# EAGLE design SurfaceEEG_Central_V1.0 (EAGLE 7.7.0)
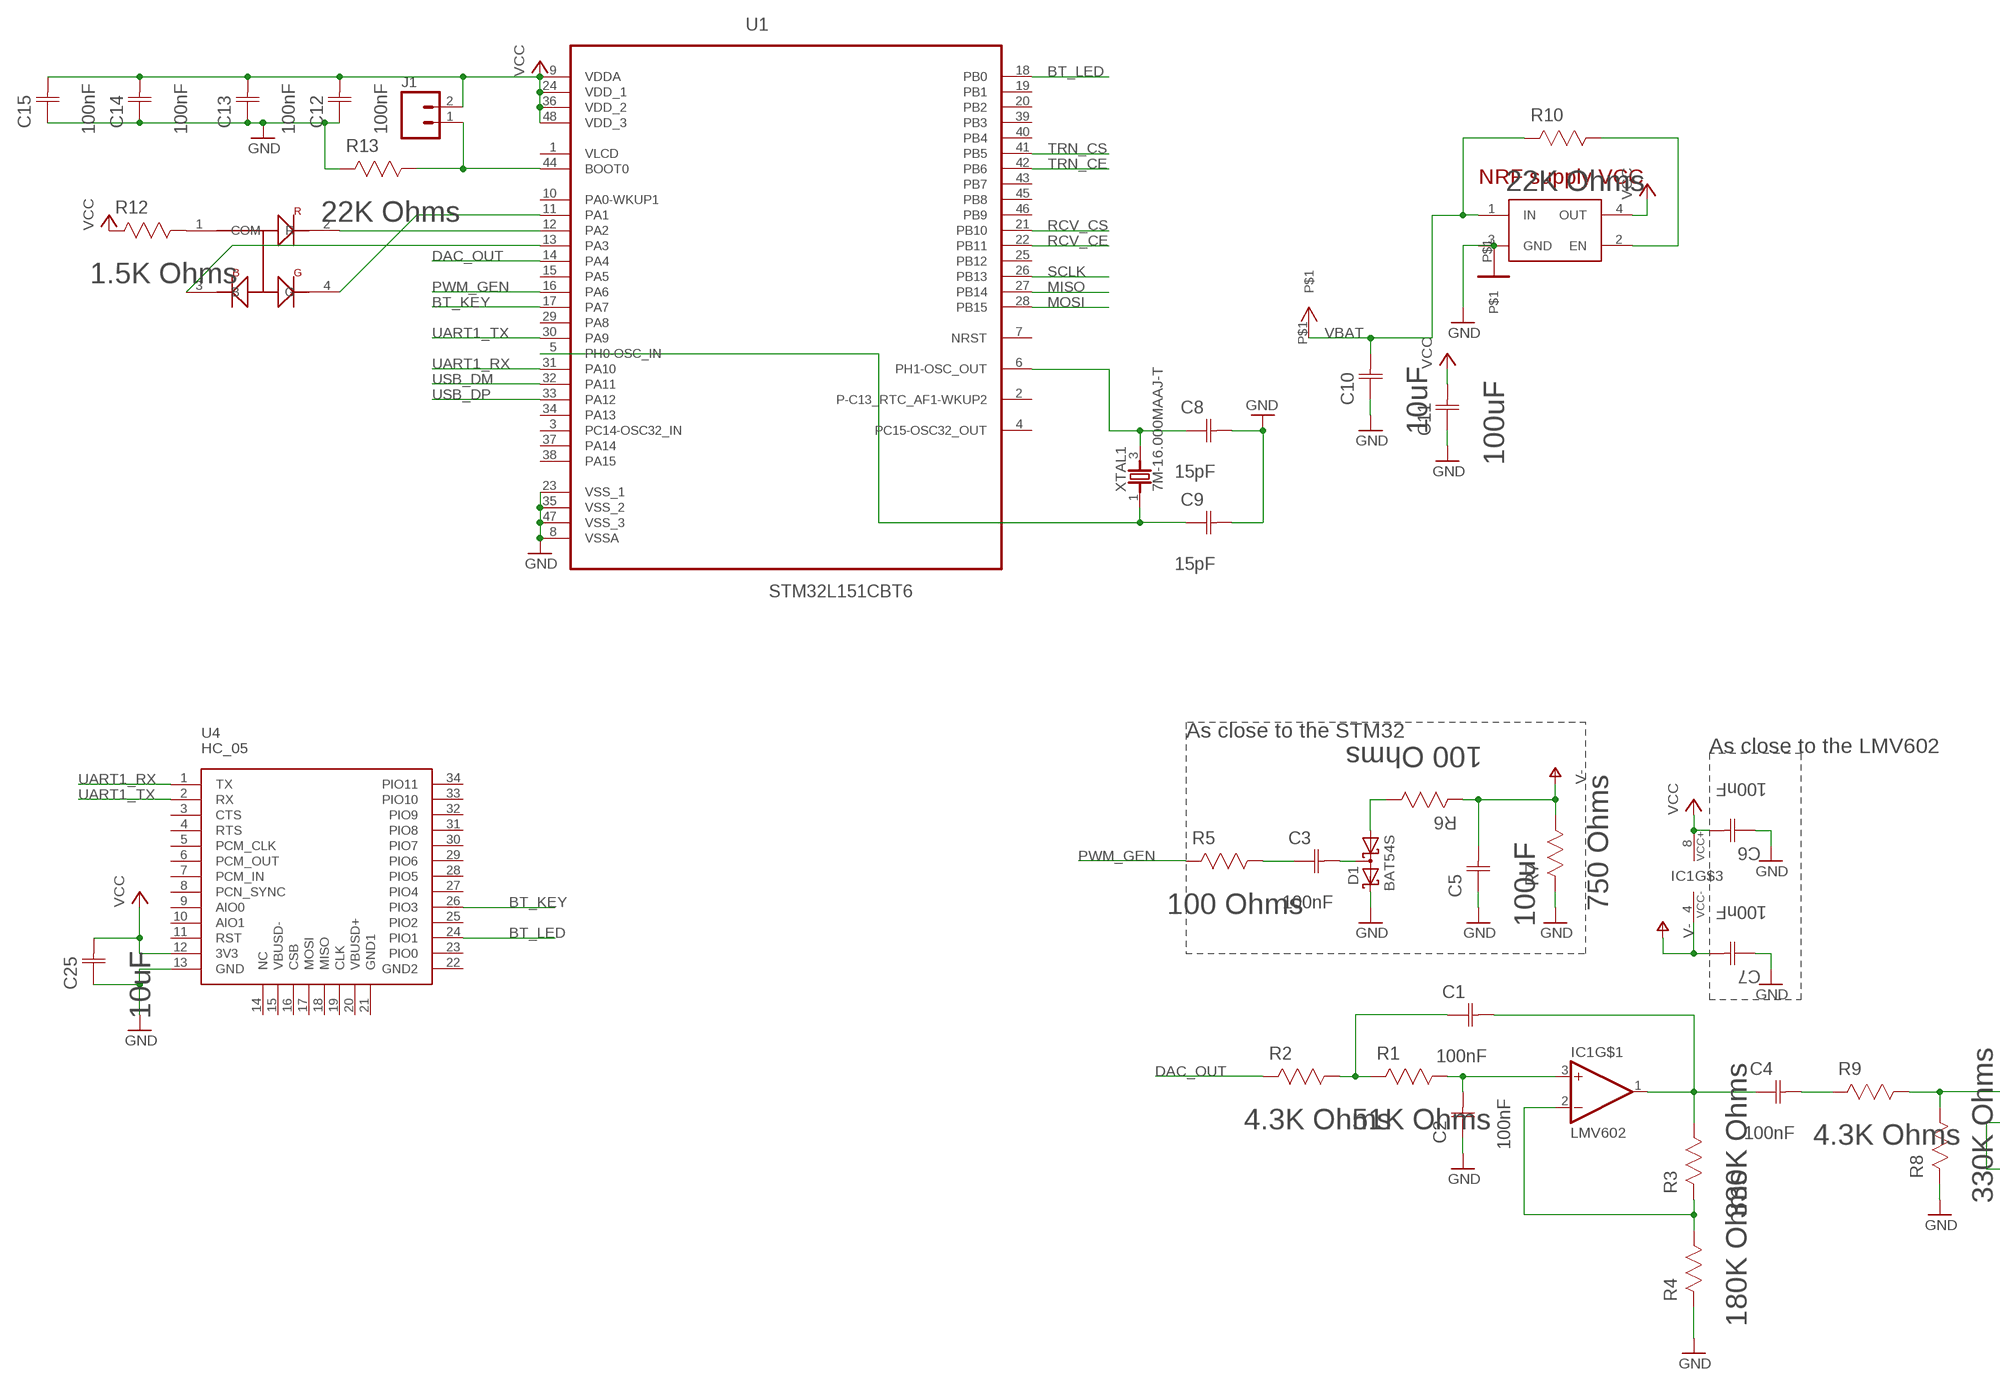
[diagram p0: schematic, sheet 1, part 1 of 2]
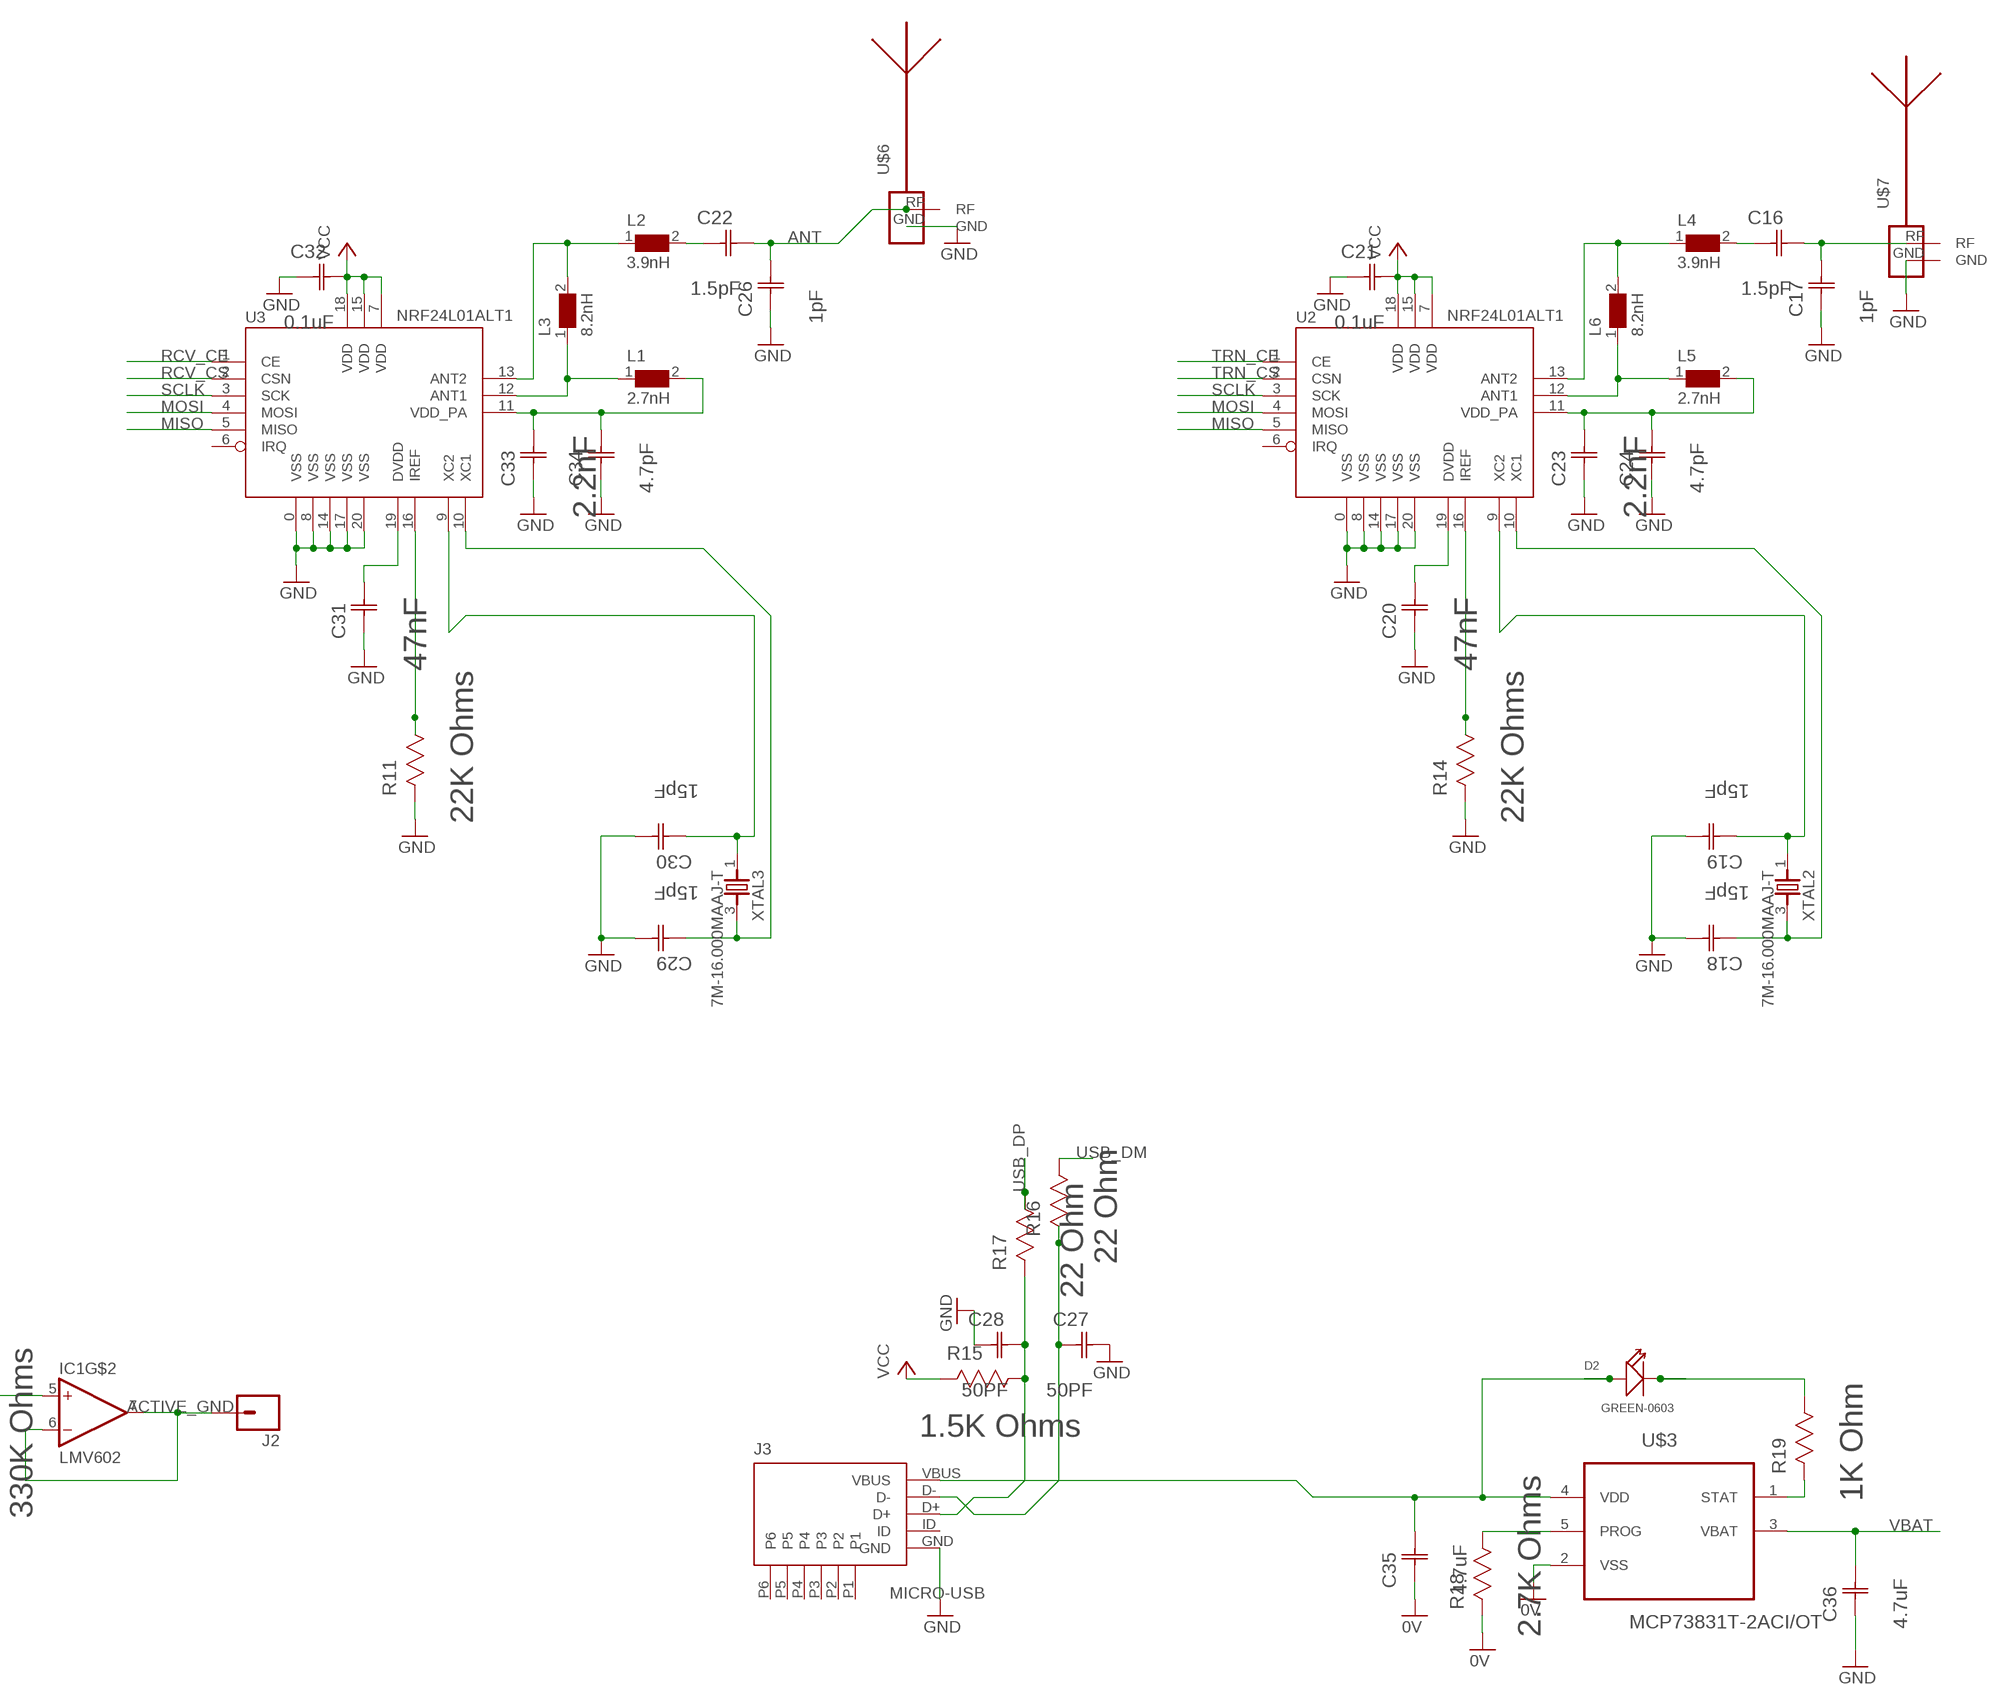
[diagram p1: schematic, sheet 1, part 2 of 2]

## Parts
C1  100nF  06035C104KAT2A  [CAPC1608X90N]
C2  100nF  06035C104KAT2A  [CAPC1608X90N]
C3  100nF  06035C104KAT2A  [CAPC1608X90N]
C4  100nF  06035C104KAT2A  [CAPC1608X90N]
C5  100uF  C1206C107M9PACTU  [CAPC3216X180N]
C6  100nF  06035C104KAT2A  [CAPC1608X90N]
C7  100nF  06035C104KAT2A  [CAPC1608X90N]
C8  15pF  UQCL2A150JAT2A/500  [CAPC1005X60N]
C9  15pF  UQCL2A150JAT2A/500  [CAPC1005X60N]
C10  10uF  C0603C106M9PACTU  [CAPC1608X85N]
C11  100uF  C1206C107M9PACTU  [CAPC3216X180N]
C12  100nF  06035C104KAT2A  [CAPC1608X90N]
C13  100nF  06035C104KAT2A  [CAPC1608X90N]
C14  100nF  06035C104KAT2A  [CAPC1608X90N]
C15  100nF  06035C104KAT2A  [CAPC1608X90N]
C16  1.5pF  UQCL2A1R5BAT2A/500  [CAPC1005X60N]
C17  1pF  UQCL2A1R0BAT2A/500  [CAPC1005X60N]
C18  15pF  UQCL2A150JAT2A/500  [CAPC1005X60N]
C19  15pF  UQCL2A150JAT2A/500  [CAPC1005X60N]
C20  47nF  C0603C473K1RACTU  [CAPC1608X85N]
C21  0.1uF  04023C104KAT2A  [CAPC1005X60N]
C22  1.5pF  UQCL2A1R5BAT2A/500  [CAPC1005X60N]
C23  2.2nF  C0402C222K5RACTU  [CAPC1005X60N]
C24  4.7pF  UQCL2A4R7CAT2A/500  [CAPC1005X60N]
C25  10uF  C0603C106M9PACTU  [CAPC1608X85N]
C26  1pF  UQCL2A1R0BAT2A/500  [CAPC1005X60N]
C27  50PF  06035A500JAT2A  [CAPC1608X90N]
C28  50PF  06035A500JAT2A  [CAPC1608X90N]
C29  15pF  UQCL2A150JAT2A/500  [CAPC1005X60N]
C30  15pF  UQCL2A150JAT2A/500  [CAPC1005X60N]
C31  47nF  C0603C473K1RACTU  [CAPC1608X85N]
C32  0.1uF  04023C104KAT2A  [CAPC1005X60N]
C33  2.2nF  C0402C222K5RACTU  [CAPC1005X60N]
C34  4.7pF  UQCL2A4R7CAT2A/500  [CAPC1005X60N]
C35  4.7uF  0805YC475KAT2A  [CAPC2013X152N]
C36  4.7uF  0805YC475KAT2A  [CAPC2013X152N]
D1  BAT54S  [SOT23]
D2  GREEN-0603  SMD-LED-CLEAR-GREEN(0603)  [LED-0603]
IC1  LMV602  [VSSOP8]
J1  M02PTH  [1X02]
J2  M01SMD-4.5X1.5  [PAD-1.5X4.5]
J3  MICRO-USB  [MICRO_USB]
L1  2.7nH  WE-KI-744765027A_0402A  [WE-KI_0402A]
L2  3.9nH  WE-KI-744765039A_0402A  [WE-KI_0402A]
L3  8.2nH  WE-KI-744765082A_0402A  [WE-KI_0402A]
L4  3.9nH  WE-KI-744765039A_0402A  [WE-KI_0402A]
L5  2.7nH  WE-KI-744765027A_0402A  [WE-KI_0402A]
L6  8.2nH  WE-KI-744765082A_0402A  [WE-KI_0402A]
R1  51K Ohms  RC0603FR-0751KL  [RESC1608X60N]
R2  4.3K Ohms  RC0603FR-074K3L  [RESC1608X60N]
R3  330K Ohms  RC0603JR-07330KL  [RESC1608X60N]
R4  180K Ohms  RC0603JR-07180KL  [RESC1608X60N]
R5  100 Ohms  RC0603FR-07100RL  [RESC1608X60N]
R6  100 Ohms  RC0603FR-07100RL  [RESC1608X60N]
R7  750 Ohms  RC0603FR-07750RL  [RESC1608X60N]
R8  330K Ohms  RC0603JR-07330KL  [RESC1608X60N]
R9  4.3K Ohms  RC0603FR-074K3L  [RESC1608X60N]
R10  22K Ohms  RC0603FR-0722KL  [RESC1608X60N]
R11  22K Ohms  RC0603FR-0722KL  [RESC1608X60N]
R12  1.5K Ohms  RC0603FR-071K5L  [RESC1608X60N]
R13  22K Ohms  RC0603FR-0722KL  [RESC1608X60N]
R14  22K Ohms  RC0603FR-0722KL  [RESC1608X60N]
R15  1.5K Ohms  RC0603FR-071K5L  [RESC1608X60N]
R16  22 Ohm  9C06031A22R0JLHFT  [RESC1608X60N]
R17  22 Ohm  9C06031A22R0JLHFT  [RESC1608X60N]
R18  2.7K Ohms  RC0603FR-072K7L  [RESC1608X60N]
R19  1K Ohm  9C06031A1001JLHFT  [RESC1608X60N]
U1  STM32L151CBT6  [QFP50P900X900X160-48N]
U2  NRF24L01ALT1  [QFN20_ALT1]
U3  NRF24L01ALT1  [QFN20_ALT1]
U4  HC_05  [BLUETOOTH_SMD]
U$1  NCP103  [UDFN4-1*1]
U$2  RGB-LED  [1615-RGB-LED]
U$3  MCP73831T-2ACI/OT  [SOT95P280X145-5N]
U$4  VCC  [VCC-PAD]
U$5  GND  [GND-PAD]
U$6  ANTENNA_1LEFT  [SWRA117D_LEFT]
U$7  ANTENNA_1RIGHT  [SWRA117D_RIGHT]
XTAL1  7M-16.000MAAJ-T  [TXC_7M-16.000MAAJ-T]
XTAL2  7M-16.000MAAJ-T  [TXC_7M-16.000MAAJ-T]
XTAL3  7M-16.000MAAJ-T  [TXC_7M-16.000MAAJ-T]

## Nets
0V: C35.1(C1) R18.2(R2) U$3.2(VSS)
ACTIVE_GND: IC1.6(IN-) IC1.7(OUT) J2.P$1
ANT: C22.1(C2) C26.1(C2) U$6.RF
ANT1: L1.1 L3.1 U3.12(ANT1)
ANT2: L2.1 L3.2 U3.13(ANT2)
ANT3: L4.1 L6.2 U2.13(ANT2)
ANT4: L5.1 L6.1 U2.12(ANT1)
BT_KEY: U1.17(PA7) U4.26(PIO3)
BT_LED: U1.18(PB0) U4.24(PIO1)
DAC_OUT: R2.2(R2) U1.14(PA4)
GND: C2.1(C1) C5.1(C1) C6.1(C1) C7.1(C1) C8.1(C2) C9.1(C2) C10.1(C1) C11.1(C1) C12.1(C1) C13.1(C1) C14.1(C1) C15.1(C1) C17.2(C1) C18.1(C2) C19.1(C2) C20.1(C1) C21.2(C1) C23.1(C1) C24.2(C1) C25.1(C1) C26.2(C1) C27.2(C2) C28.1(C1) C29.1(C2) C30.1(C2) C31.1(C1) C32.2(C1) C33.1(C1) C34.2(C1) C36.1(C1) D1.2(C2) J3.GND R4.2(R2) R7.2(R2) R8.2(R2) R11.2(R2) R13.2(R2) R14.2(R2) U1.8(VSSA) U1.23(VSS_1) U1.35(VSS_2) U1.47(VSS_3) U2.0(VSS) U2.8(VSS) U2.14(VSS) U2.17(VSS) U2.20(VSS) U3.0(VSS) U3.8(VSS) U3.14(VSS) U3.17(VSS) U3.20(VSS) U4.13(GND) U$1.3(GND) U$5.P$1 U$6.GND U$7.GND
MISO: U1.27(PB14) U2.5(MISO) U3.5(MISO)
MOSI: U1.28(PB15) U2.4(MOSI) U3.4(MOSI)
N$1: C1.1(C1) R1.2(R2) R2.1(R1)
N$2: IC1.2(IN-) R3.2(R2) R4.1(R1)
N$3: C1.2(C2) C4.1(C1) IC1.1(OUT) R3.1(R1)
N$4: C2.2(C2) IC1.3(IN+) R1.1(R1)
N$5: IC1.5(IN+) R8.1(R1) R9.1(R1)
N$6: C4.2(C2) R9.2(R2)
N$7: C3.1(C1) R5.1(R1)
N$8: C3.2(C2) D1.3(C1A2)
N$9: D1.1(A1) R6.1(R1)
N$10: C29.2(C1) U3.10(XC1) XTAL3.3
N$11: R10.1(R1) U$1.2(EN)
N$12: C30.2(C1) U3.9(XC2) XTAL3.1
N$13: C22.2(C1) L2.2
N$14: C8.2(C1) U1.6(PH1-OSC_OUT) XTAL1.3
N$15: C9.2(C1) U1.5(PH0-OSC_IN) XTAL1.1
N$16: C33.2(C2) C34.1(C2) L1.2 U3.11(VDD_PA)
N$17: U1.12(PA2) U$2.2(R)
N$18: U1.13(PA3) U$2.3(B)
N$19: R11.1(R1) U3.16(IREF)
N$20: C31.2(C2) U3.19(DVDD)
N$21: U1.11(PA1) U$2.4(G)
N$22: R12.1(R1) U$2.1(COM)
N$23: J1.1 R13.1(R1) U1.44(BOOT0)
N$24: C18.2(C1) U2.10(XC1) XTAL2.3
N$25: C23.2(C2) C24.1(C2) L5.2 U2.11(VDD_PA)
N$26: R14.1(R1) U2.16(IREF)
N$27: C20.2(C2) U2.19(DVDD)
N$28: C16.2(C1) L4.2
N$29: C19.2(C1) U2.9(XC2) XTAL2.1
N$30: C16.1(C2) C17.1(C2) U$7.RF
N$31: C35.2(C2) D2.+ J3.VBUS U$3.4(VDD)
N$32: C28.2(C2) J3.D+ R15.1(R1) R17.2(R2)
N$33: C27.1(C1) J3.D- R16.2(R2)
N$34: R18.1(R1) U$3.5(PROG)
N$36: D2.- R19.1(R1)
N$37: R19.2(R2) U$3.1(STAT)
PWM_GEN: R5.2(R2) U1.16(PA6)
RCV_CE: U1.22(PB11) U3.1(CE)
RCV_CS: U1.21(PB10) U3.2(CSN)
SCLK: U1.26(PB13) U2.3(SCK) U3.3(SCK)
TRN_CE: U1.42(PB6) U2.1(CE)
TRN_CS: U1.41(PB5) U2.2(CSN)
UART1_RX: U1.31(PA10) U4.1(TX)
UART1_TX: U1.30(PA9) U4.2(RX)
USB_DM: R16.1(R1) U1.32(PA11)
USB_DP: R17.1(R1) U1.33(PA12)
V-: C5.2(C2) C7.2(C2) IC1.4(VCC-) R6.2(R2) R7.1(R1)
VBAT: C10.2(C2) C36.2(C2) R10.2(R2) U$1.1(IN) U$3.3(VBAT) U$4.P$1
VCC: C6.2(C2) C11.2(C2) C12.2(C2) C13.2(C2) C14.2(C2) C15.2(C2) C21.1(C2) C25.2(C2) C32.1(C2) IC1.8(VCC+) J1.2 R12.2(R2) R15.2(R2) U1.9(VDDA) U1.24(VDD_1) U1.36(VDD_2) U1.48(VDD_3) U2.7(VDD) U2.15(VDD) U2.18(VDD) U3.7(VDD) U3.15(VDD) U3.18(VDD) U4.12(3V3) U$1.4(OUT)
Unconnected: J3.ID J3.P1 J3.P2 J3.P3 J3.P4 J3.P5 J3.P6 U1.2(P-C13_RTC_AF1-WKUP2) U1.3(PC14-OSC32_IN) U1.4(PC15-OSC32_OUT) U1.7(NRST) U1.10(PA0-WKUP1) U1.15(PA5) U1.19(PB1) U1.20(PB2) U1.25(PB12) U1.29(PA8) U1.34(PA13) U1.37(PA14) U1.38(PA15) U1.39(PB3) U1.40(PB4) U1.43(PB7) U1.45(PB8) U1.46(PB9) U2.6(IRQ) U3.6(IRQ) U4.3(CTS) U4.4(RTS) U4.5(PCM_CLK) U4.6(PCM_OUT) U4.7(PCM_IN) U4.8(PCN_SYNC) U4.9(AIO0) U4.10(AIO1) U4.11(RST) U4.14(NC) U4.15(VBUSD-) U4.16(CSB) U4.17(MOSI) U4.18(MISO) U4.19(CLK) U4.20(VBUSD+) U4.21(GND1) U4.22(GND2) U4.23(PIO0) U4.25(PIO2) U4.27(PIO4) U4.28(PIO5) U4.29(PIO6) U4.30(PIO7) U4.31(PIO8) U4.32(PIO9) U4.33(PIO10) U4.34(PIO11)

## Notes on the sheet
- NRF supply VCC
- As close to the STM32
- As close to the LMV602

## Power pins joined to a net without a drawn wire
VLCD: U1.1(VLCD)

## Library data of the parts
C1-C4 C6 C7 C12-C15 = (manufact)-capacitors-AVX-element14:06035C104KAT2A: Capacitor 0603; MPN: 06035C104KAT2A; OC_FARNELL: 1301804; OC_NEWARK: 54K2412; SUPPLIER: AVX; TOLERANCE: ±10%; VOLTAGERATING: 50V
C5 C11 = (manufact)-Kemet-element14:C1206C107M9PACTU: CAPACITOR, 1206; MPN: C1206C107M9PACTU; OC_FARNELL: 1358552; OC_NEWARK: 94M5669; SUPPLIER: Kemet; TOLERANCE: ±20%; VOLTAGERATING: 6.3V
C8 C9 C18 C19 C29 C30 = (manufact)-capacitors-AVX-element14:UQCL2A150JAT2A/500: Capacitor 0402; MPN: UQCL2A150JAT2A/500; OC_FARNELL: -; OC_NEWARK: 32T8795; SUPPLIER: AVX; TOLERANCE: ±5%; VOLTAGERATING: 200V
C10 C25 = (manufact)-Kemet-element14:C0603C106M9PACTU: CAPACITOR, 0603; MPN: C0603C106M9PACTU; OC_FARNELL: 1288201; OC_NEWARK: 93K5998; SUPPLIER: Kemet; TOLERANCE: ±20%; VOLTAGERATING: 6.3V
C16 C22 = (manufact)-capacitors-AVX-element14:UQCL2A1R5BAT2A/500: Capacitor 0402; MPN: UQCL2A1R5BAT2A/500; OC_FARNELL: -; OC_NEWARK: 32T8784; SUPPLIER: AVX; TOLERANCE: ±.1 pF; VOLTAGERATING: 200V
C17 C26 = (manufact)-capacitors-AVX-element14:UQCL2A1R0BAT2A/500: Capacitor 0402; MPN: UQCL2A1R0BAT2A/500; OC_FARNELL: -; OC_NEWARK: 32T8778; SUPPLIER: AVX; TOLERANCE: ±.1 pF; VOLTAGERATING: 200V
C20 C31 = (manufact)-Kemet-element14:C0603C473K1RACTU: CAPACITOR, 0603; MPN: C0603C473K1RACTU; OC_FARNELL: 1865550; OC_NEWARK: 29T9032; SUPPLIER: KEMET; TOLERANCE: ±10%; VOLTAGERATING: 100V
C21 C32 = (manufact)-capacitors-AVX-element14:04023C104KAT2A: Capacitor 0402; MPN: 04023C104KAT2A; OC_FARNELL: 1867948; OC_NEWARK: 37T9047; SUPPLIER: AVX; TOLERANCE: ±10%; VOLTAGERATING: 25V
C23 C33 = (manufact)-Kemet-element14:C0402C222K5RACTU: CAPACITOR, 0402; MPN: C0402C222K5RACTU; OC_FARNELL: 1414582; OC_NEWARK: 70K9080; SUPPLIER: Kemet; TOLERANCE: ±10%; VOLTAGERATING: 50V
C24 C34 = (manufact)-capacitors-AVX-element14:UQCL2A4R7CAT2A/500: Capacitor 0402; MPN: UQCL2A4R7CAT2A/500; OC_FARNELL: -; OC_NEWARK: 32T8823; SUPPLIER: AVX; TOLERANCE: ±.25 pF; VOLTAGERATING: 200V
C27 C28 = (manufact)-capacitors-AVX-element14:06035A500JAT2A: CAPACITOR , 0603; MPN: 06035A500JAT2A; OC_FARNELL: -; OC_NEWARK: 55J4427; SUPPLIER: AVX; TOLERANCE: ±5%; VOLTAGERATING: 50V
C35 C36 = (manufact)-capacitors-AVX-element14:0805YC475KAT2A: Capacitor 0805; MPN: 0805YC475KAT2A; OC_FARNELL: 1657937; OC_NEWARK: 15P4051; SUPPLIER: AVX; TOLERANCE: ±10%; VOLTAGERATING: 16V
D1 = (misc)-parts-that-we-use:BAT54S: Schottky Diodes Pin connection corrected 2011-05-04 Source: Fairchild .. BAT54.pdf
D2 = Seeed-OPL-Diode:SMD-LED-CLEAR-GREEN(0603): 304090043; MPN: 19-217-G7C-AN1P2-3T
IC1 = (custom)-new-components:LMV602: The library has been designed by Richard Magdycz <https://www.facebook.com/groups/eaglecadsoftUK>; MPN: LMV602MM/NOPB
J1 = SparkFun-Connectors:M02: Standard 2-pin 0.1" header. Use with - straight break away headers ( PRT-00116) - right angle break away headers (PRT-00553) - swiss pins (PRT-00743) - machine pins (PRT-00117) - female headers (PRT-00115) Molex polarized connector foot print use with: PRT-08233 with associated crimp pins and housings. 2.54_SCREWTERM for use with PRT-10571. 3.5mm Screw Terminal footprints for PRT-08084 5mm Screw Terminal footprints for use with PRT-08432
J2 = SparkFun-Connectors:M01: Header 1 Standard 1-pin 0.1" header. Use with straight break away headers (SKU : PRT-00116), right angle break away headers (PRT-00553), swiss pins (PRT-00743), machine pins (PRT-00117), and female headers (PRT-00115). SMTSO-256-ET is a "flush mount" nut for a 4-40 screw. The older package used to be too tight, and did not allow it to sit properly thru the drill hit. The latest (0.165DIA) fits nice and snug.
J3 = (misc)-parts-that-we-use:MICRO-USB: Micro USB from Molex CONN RCPT 5POS MICRO USB R/A Datasheet <http://www.molex.com/pdm_docs/sd/473460001_sd.pdf>; MPN: 47346-0001; PARTNO: AS-ITM-00021
L1 L5 = (manufact)-inductors-WE-KI-element14:WE-KI: SMD Wire Wound Ceramic Inductor WE-KI - Wire wound - High thermal stability - Rated current up to 1 A - High Q-factor - High SRF - Inductance tolerances: 5% (2% upon request) -- Especially developed for high frequency applications -- Perfect for applications in telecommunications -- Bluetooth -- Wireless LAN; MPN: 744765027A; OC_FARNELL: 1748703; OC_NEWARK: 34R6062; PACKAGE: IND-0402; SUPPLIER: Wuerth Elektronik
L2 L4 = (manufact)-inductors-WE-KI-element14:WE-KI: SMD Wire Wound Ceramic Inductor WE-KI - Wire wound - High thermal stability - Rated current up to 1 A - High Q-factor - High SRF - Inductance tolerances: 5% (2% upon request) -- Especially developed for high frequency applications -- Perfect for applications in telecommunications -- Bluetooth -- Wireless LAN; MPN: 744765039A; OC_FARNELL: 1748706; OC_NEWARK: 34R6065; PACKAGE: IND-0402; SUPPLIER: Wuerth Elektronik
L3 L6 = (manufact)-inductors-WE-KI-element14:WE-KI: SMD Wire Wound Ceramic Inductor WE-KI - Wire wound - High thermal stability - Rated current up to 1 A - High Q-factor - High SRF - Inductance tolerances: 5% (2% upon request) -- Especially developed for high frequency applications -- Perfect for applications in telecommunications -- Bluetooth -- Wireless LAN; MPN: 744765082A; OC_FARNELL: 1748715; OC_NEWARK: 34R6073; PACKAGE: IND-0402; SUPPLIER: Wuerth Elektronik
R1 = (manufact)-resistors-YAGEO-element14:RC0603FR-0751KL: RESISTOR, 0603; MPN: RC0603FR-0751KL; OC_FARNELL: 1799349; OC_NEWARK: 68R0103; SUPPLIER: Yageo; TOLERANCE: ±1%; WATTAGE: 1/10 W
R2 R9 = (manufact)-resistors-YAGEO-element14:RC0603FR-074K3L: RESISTOR, 0603; MPN: RC0603FR-074K3L; OC_FARNELL: -; OC_NEWARK: 06R3079; SUPPLIER: Yageo; TOLERANCE: ±1%; WATTAGE: 1/10 W
R3 R8 = (manufact)-resistors-YAGEO-element14:RC0603JR-07330KL: RESISTOR, 0603; MPN: RC0603JR-07330KL; OC_FARNELL: 9233687; OC_NEWARK: 68R0183; SUPPLIER: Yageo; TOLERANCE: ±5%; WATTAGE: 1/10 W
R4 = (manufact)-resistors-YAGEO-element14:RC0603JR-07180KL: RESISTOR, 0603; MPN: RC0603JR-07180KL; OC_FARNELL: 9233652; OC_NEWARK: 98K7301; SUPPLIER: Yageo; TOLERANCE: ±5%; WATTAGE: 1/10 W
R5 R6 = (manufact)-resistors-YAGEO-element14:RC0603FR-07100RL: RESISTOR, 0603; MPN: RC0603FR-07100RL; OC_FARNELL: 1117232; OC_NEWARK: 68R0052; SUPPLIER: Yageo; TOLERANCE: ±1%; WATTAGE: 1/10 W
R7 = (manufact)-resistors-YAGEO-element14:RC0603FR-07750RL: RESISTOR, 0603; MPN: RC0603FR-07750RL; OC_FARNELL: -; OC_NEWARK: 51P2986; SUPPLIER: Yageo; TOLERANCE: ±1%; WATTAGE: 1/10 W
R10 R11 R13 R14 = (manufact)-resistors-YAGEO-element14:RC0603FR-0722KL: RESISTOR, 0603; MPN: RC0603FR-0722KL; OC_FARNELL: 1117251; OC_NEWARK: 68R0072; SUPPLIER: Yageo; TOLERANCE: ±1%; WATTAGE: 1/10 W
R12 R15 = (manufact)-resistors-YAGEO-element14:RC0603FR-071K5L: RESISTOR, 0603; MPN: RC0603FR-071K5L; OC_FARNELL: 1117242; OC_NEWARK: 68R0045; SUPPLIER: Yageo; TOLERANCE: ±1%; WATTAGE: 1/10 W
R16 R17 = (manufact)-resistors-YAGEO-element14:9C06031A22R0JLHFT: RESISTOR, 0603; MPN: 9C06031A22R0JLHFT; OC_FARNELL: -; OC_NEWARK: 96H0458; SUPPLIER: Yageo; TOLERANCE: ±5%; WATTAGE: 0.1 W
R18 = (manufact)-resistors-YAGEO-element14:RC0603FR-072K7L: RESISTOR, 0603; MPN: RC0603FR-072K7L; OC_FARNELL: 9238530; OC_NEWARK: 68R0067; SUPPLIER: Yageo; TOLERANCE: ±1%; WATTAGE: 1/10 W
R19 = (manufact)-resistors-YAGEO-element14:9C06031A1001JLHFT: RESISTOR, 0603; MPN: 9C06031A1001JLHFT; OC_FARNELL: -; OC_NEWARK: 37J1397; SUPPLIER: Yageo; TOLERANCE: ±5%; WATTAGE: 0.1 W
U1 = (misc)-parts-that-we-use:STM32L151CBT6: ARM-based 32-bit MCU; MPN: STM32L151CBT6; OC_FARNELL: 2060925; OC_NEWARK: 65T3786; PACKAGE: LQFP-48; SUPPLIER: STMICROELECTRONICS
U2 U3 = Testing:NRF24L01: 2.4GHz Low Power Transceiver This is the very popular, low cost, very low power RF transceiver from Nordic Semiconductor. Simple SPI interface. SKU: COM-00690
U4 = HC_08:HC_05: HC-05 Bluetooth Module
U$1 = (custom)-new-components:NCP103: NCP103AMX330TCG 3.3V LDO: 75mV dropout, 150 mA http://www.onsemi.com/pub_link/Collateral/NCP103-D.PDF; MPN: NCP103AMX330TCG
U$2 = (custom)-new-components:RGB-LED
U$3 = (custom)-new-components:MCP73831T-2ACI/OT: Charge Management Controller; MPN: MCP73831T-2ACI/OT; OC_FARNELL: 1332158; OC_NEWARK: 56K7045; PACKAGE: SOT-5; SUPPLIER: Microchip
U$4 = (custom)-new-components:VCC
U$5 = (custom)-new-components:GND
U$6 U$7 = ant-planar-1:ANTENNA_1
XTAL1-XTAL3 = (misc)-parts-that-we-use:7M-16.000MAAJ-T: CRYSTAL SEAM, 16MHZ, 18PF, SMD; MPN: 7M-16.000MAAJ-T; OC_FARNELL: 1842060; OC_NEWARK: 84R5710; PACKAGE: SMD; SUPPLIER: TXC

## Board
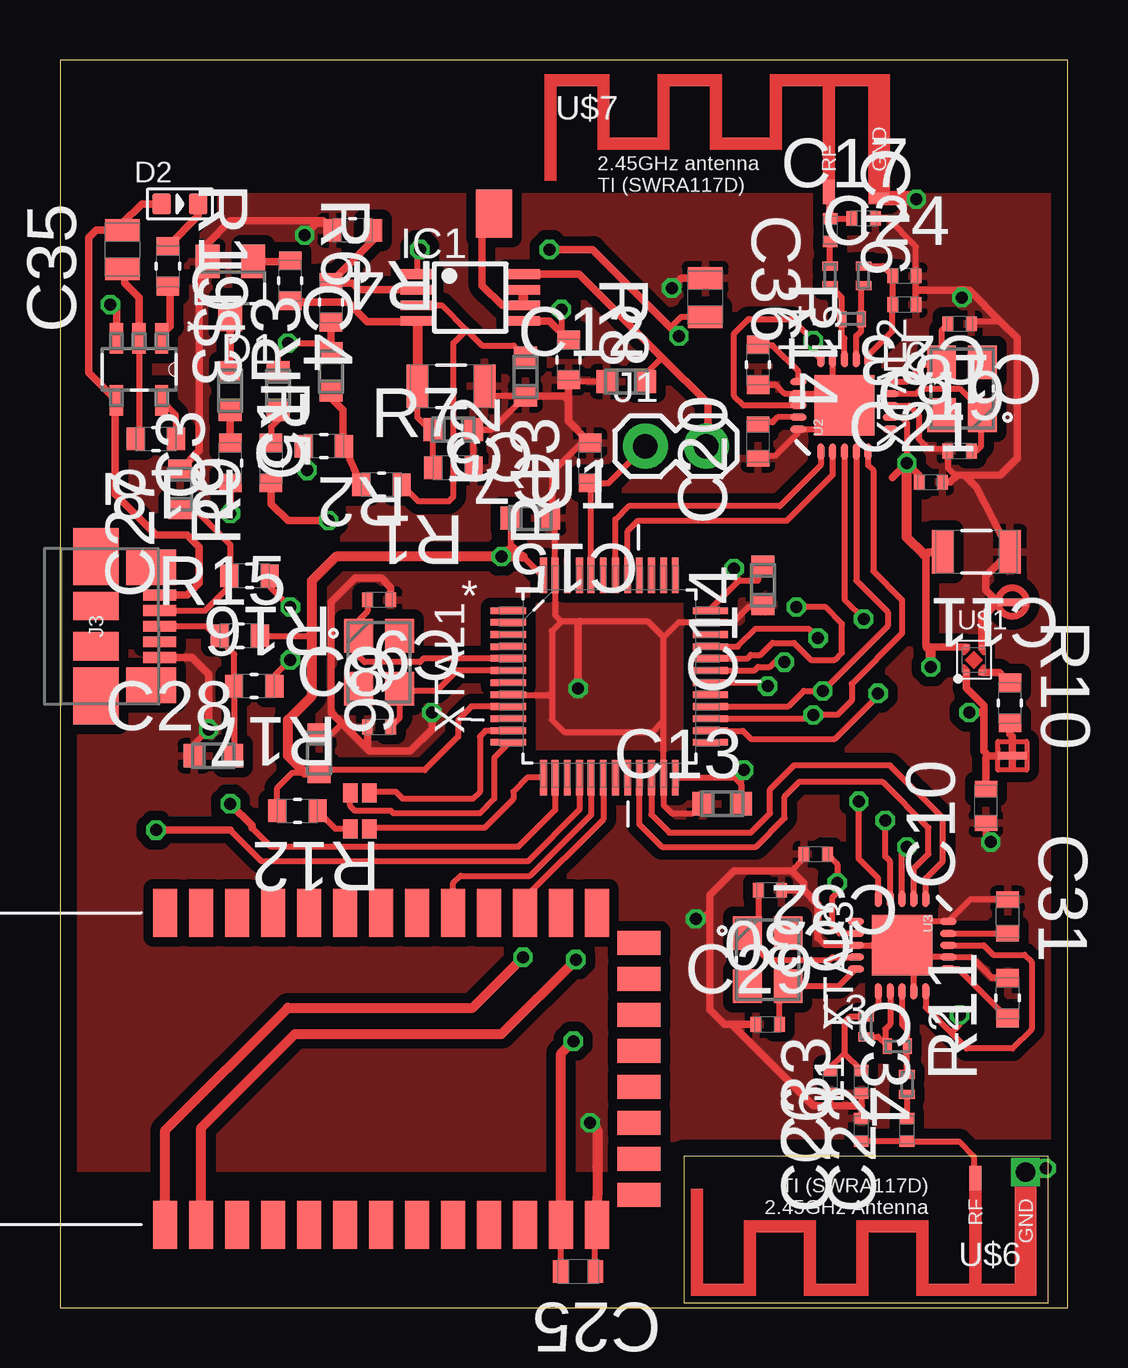
[diagram p2: board, top side]
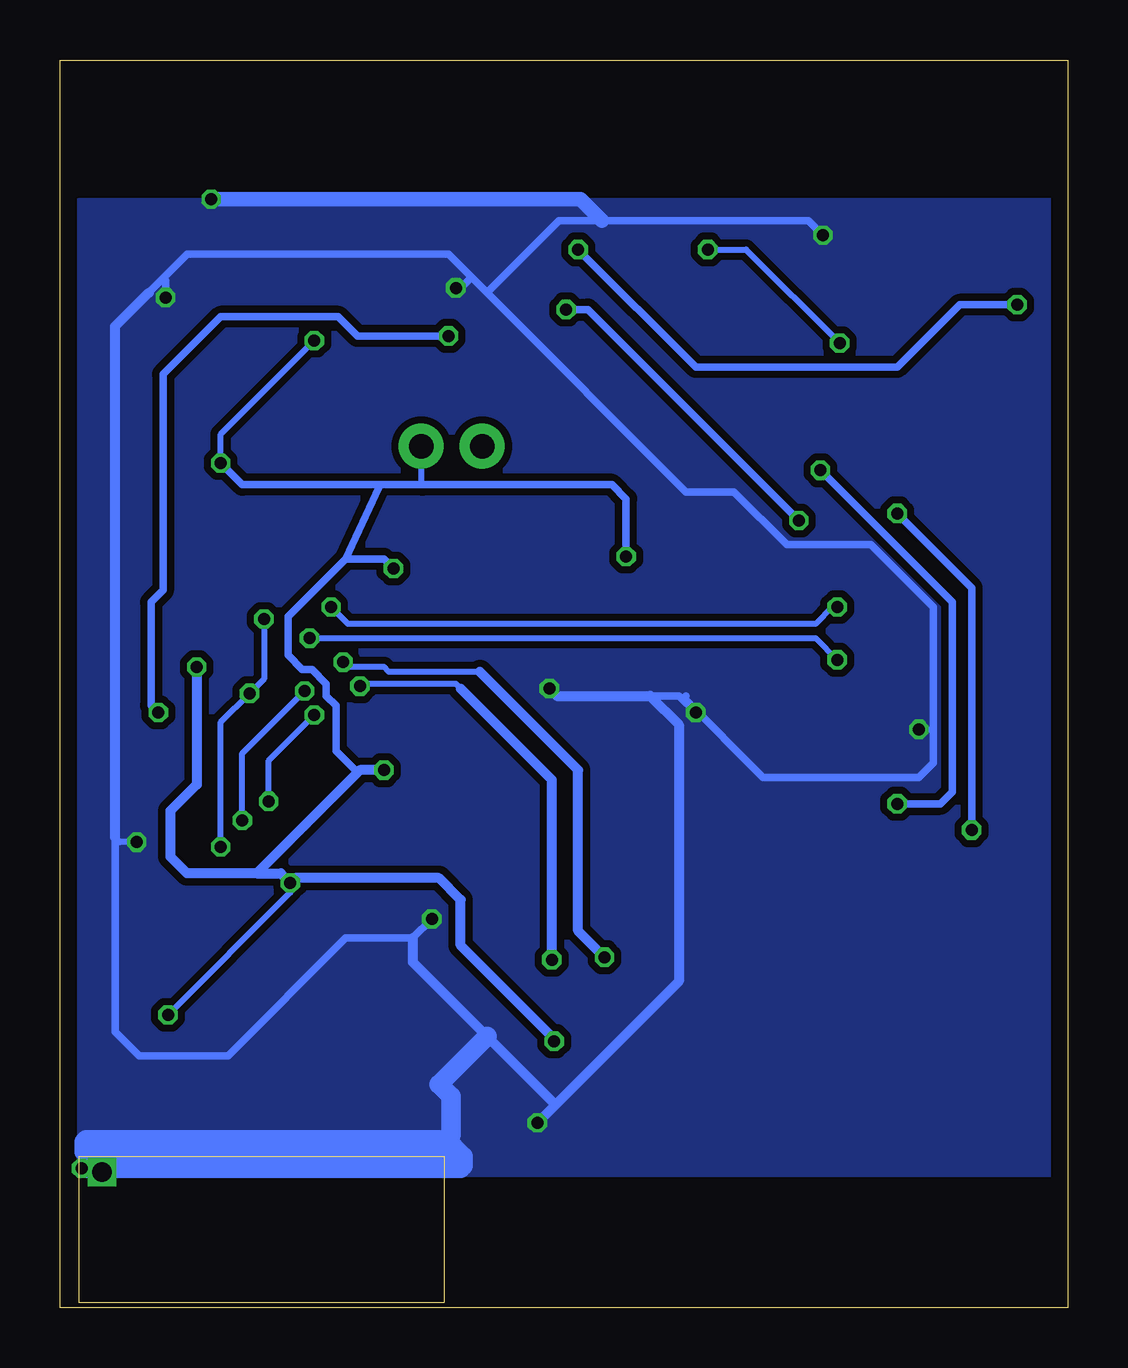
[diagram p3: board, bottom side, seen from below]

Size 42 x 52 mm. Coordinates in mm from the lower left corner, seen from the top.
Outline: 0,0 42,0 42,52 0,52 0,0
Copper layers (1*16): Top 0.035mm / dielectric 1.5mm / Bottom 0.035mm
Design rules "rules_Kharkiv *": minimum track width 8mil, minimum drill 15mil, track to track 0.2mm, track to pad 0.2mm, pad to pad 0.2mm, via to via 0.2mm, smd to smd 0mil, copper to edge 0.7mm, drill to drill 8mil, minimum pad ring 7mil, minimum via ring 6mil, stop-mask expansion 4mil, vias tented up to drill 0mil, thermal gap 10mil

### Footprints (pad centres in the part's own frame; a part is rotated, then mirrored left to right if it is on the bottom)
CAPC1608X90N = smd 0.864 x 0.965: 1 -0.813,0; 2 0.813,0
CAPC3216X180N = smd 0.914 x 1.803: 1 -1.397,0; 2 1.397,0
CAPC1005X60N = smd 0.457 x 0.61: 1 -0.483,0; 2 0.483,0
CAPC1608X85N = smd 0.66 x 0.94: 1 -0.711,0; 2 0.711,0
CAPC2013X152N = smd 0.914 x 1.448: 1 -0.813,0; 2 0.813,0
SOT23 = smd 1 x 1.4: 1 -0.95,-1.1; 2 0.95,-1.1; 3 0,1.1
LED-0603 = smd 0.762 x 0.889: + -0.762,0; - 0.762,0
VSSOP8 = smd 1.4 x 0.4: 1 -2.2,0.975; 2 -2.2,0.325; 3 -2.2,-0.325; 4 -2.2,-0.975; 5 2.2,-0.975; 6 2.2,-0.325; 7 2.2,0.325; 8 2.2,0.975
1X02 = drill 1.016 pad 1.88: 1 0,0; 2 2.54,0
PAD-1.5X4.5 = smd 1.5 x 2: P$1 0,0
MICRO_USB = smd 1.38 x 0.45: D+ 2.66,0; D- 2.66,0.65; GND 2.66,-1.3; ID 2.66,-0.65; VBUS 2.66,1.3 | smd 2.1 x 1.475: P1 2.3,-2.462; P2 2.3,2.462 | smd 1.9 x 2.375: P3 0,2.913; P4 0,-2.913 | smd 1.9 x 1.175: P5 0,0.838; P6 0,-0.838
WE-KI_0402A = smd 0.375 x 0.65: 1 -0.412,0; 2 0.412,0
RESC1608X60N = smd 0.762 x 0.94: 1 -0.838,0; 2 0.838,0
QFP50P900X900X160-48N = smd 1.473 x 0.279: 1 -4.216,2.743; 2 -4.216,2.261; 3 -4.216,1.753; 4 -4.216,1.245; 5 -4.216,0.762; 6 -4.216,0.254; 7 -4.216,-0.254; 8 -4.216,-0.762; 9 -4.216,-1.245; 10 -4.216,-1.753; 11 -4.216,-2.261; 12 -4.216,-2.743; 25 4.216,-2.743; 26 4.216,-2.261; 27 4.216,-1.753; 28 4.216,-1.245; 29 4.216,-0.762; 30 4.216,-0.254; 31 4.216,0.254; 32 4.216,0.762; 33 4.216,1.245; 34 4.216,1.753; 35 4.216,2.261; 36 4.216,2.743 | smd 0.279 x 1.473: 13 -2.743,-4.216; 14 -2.261,-4.216; 15 -1.753,-4.216; 16 -1.245,-4.216; 17 -0.762,-4.216; 18 -0.254,-4.216; 19 0.254,-4.216; 20 0.762,-4.216; 21 1.245,-4.216; 22 1.753,-4.216; 23 2.261,-4.216; 24 2.743,-4.216; 37 2.743,4.216; 38 2.261,4.216; 39 1.753,4.216; 40 1.245,4.216; 41 0.762,4.216; 42 0.254,4.216; 43 -0.254,4.216; 44 -0.762,4.216; 45 -1.245,4.216; 46 -1.753,4.216; 47 -2.261,4.216; 48 -2.743,4.216
QFN20_ALT1 = smd 2.515 x 2.515: 0 0,0 | smd 0.686 x 0.293: 1 -1.925,0.986; 2 -1.925,0.493; 3 -1.925,0; 4 -1.925,-0.493; 5 -1.925,-0.986; 11 1.925,-0.986; 12 1.925,-0.493; 13 1.925,0; 14 1.925,0.493; 15 1.925,0.986 | smd 0.293 x 0.686: 6 -0.986,-1.925; 7 -0.493,-1.925; 8 0,-1.925; 9 0.493,-1.925; 10 0.986,-1.925; 16 0.986,1.925; 17 0.493,1.925; 18 0,1.925; 19 -0.493,1.925; 20 -0.986,1.925
BLUETOOTH_SMD = smd 2 x 1: 1 -6.35,3.81; 2 -6.35,2.31; 3 -6.35,0.81; 4 -6.35,-0.69; 5 -6.35,-2.19; 6 -6.35,-3.69; 7 -6.35,-5.19; 8 -6.35,-6.69; 9 -6.35,-8.19; 10 -6.35,-9.69; 11 -6.35,-11.19; 12 -6.35,-12.69; 13 -6.35,-14.19; 22 6.65,-14.19; 23 6.65,-12.69; 24 6.65,-11.19; 25 6.65,-9.69; 26 6.65,-8.19; 27 6.65,-6.69; 28 6.65,-5.19; 29 6.65,-3.69; 30 6.65,-2.19; 31 6.65,-0.69; 32 6.65,0.81; 33 6.65,2.31; 34 6.65,3.81 | smd 1 x 1.8: 14 -5.1,-15.94; 15 -3.6,-15.94; 16 -2.1,-15.94; 17 -0.6,-15.94; 18 0.9,-15.94; 19 2.4,-15.94; 20 3.9,-15.94; 21 5.4,-15.94
UDFN4-1*1 = smd 0.2 x 0.2: 1 -0.325,-0.525; 2 0.325,-0.525; 3 0.325,0.525; 4 -0.325,0.525
1615-RGB-LED = smd 0.8 x 0.6: 1 -0.75,0.4; 2 0.75,0.4; 3 -0.75,-0.4; 4 0.75,-0.4
SOT95P280X145-5N = smd 1.27 x 0.559: 1 -1.295,0.94; 2 -1.295,0; 3 -1.295,-0.94; 4 1.295,-0.94; 5 1.295,0.94
VCC-PAD = smd 1.2 x 0.3: P$1 0,0
GND-PAD = smd 1.2 x 0.3: P$1 0,0
SWRA117D_LEFT = drill 0.8 square: GND 0.45,0.25 | smd 0.508 x 1.016: RF 2.55,0.51
SWRA117D_RIGHT = smd 0.813 x 0.406: GND -0.45,0.25 | smd 0.508 x 1.016: RF -2.55,0.5
TXC_7M-16.000MAAJ-T = smd 1.4 x 1.2: 1 -1.1,-0.85; 2 1.1,-0.85; 3 1.1,0.85; 4 -1.1,0.85

### Placement (x,y rotation side)
C1  11.3,39 90 top
C2  19.4,38.8 90 top
C3  7.1,38.2 90 top
C4  9.1,38.2 270 top
C5  16.3,38.4 180 top
C6  10.8,23.1 270 top
C7  16.4,36.6 180 top
C8  13.3,24.2 0 top
C9  13.3,29.5 180 top
C10  38.6,20.9 90 top
C11  38.2,31.5 180 top
C12  23.6,38.6 0 top
C13  27.6,21 0 top
C14  29.3,30.1 90 top
C15  19.6,32.9 180 top
C16  32.1,44.9 270 top
C17  33.5,45.4 0 top
C18  37.5,41 180 top
C19  37.5,35.7 0 top
C20  29.1,36.1 90 top
C21  36.3,34.4 0 top
C22  35.3,7.4 90 top
C23  35.2,41.8 180 top
C24  35.2,43 0 top
C25  21.6,1.5 180 top
C26  33.4,7.4 90 top
C27  5,34.1 90 top
C28  6.4,23 0 top
C29  29.5,11.8 0 top
C30  29.6,17.4 180 top
C31  39.5,16.3 270 top
C32  31.5,18.9 180 top
C33  33.4,9.4 90 top
C34  32.1,9.4 270 top
C35  2.6,44.1 90 top
C36  26.9,42.1 270 top
D1  7.1,42.5 180 top
D2  5,46 0 top
IC1  17.1,42.1 0 top
J1  24.4,35.9 0 top
J2  18.1,45.6 180 top
J3  1.5,28.4 0 top
L1  33.6,11.7 90 top
L2  35.3,9.3 270 top
L3  34.9,10.9 0 top
L4  32.1,43 90 top
L5  33.5,43 90 top
L6  33,41.2 180 top
R1  13.4,34.3 180 top
R2  11,35.9 180 top
R3  11.3,41.9 90 top
R4  12.2,44.9 180 top
R5  7.1,35.2 270 top
R6  9.6,42.8 270 top
R7  16.4,35 0 top
R8  21.2,39.5 270 top
R9  8.8,35.2 90 top
R10  39.6,25.2 270 top
R11  39.5,12.9 90 top
R12  9.9,20.7 180 top
R13  22.1,35.2 90 top
R14  29.1,39.3 270 top
R15  7.5,28 0 top
R16  7.9,30.5 180 top
R17  8.1,25.9 180 top
R18  4,36.2 180 top
R19  4.5,43.4 270 top
U1  22.9,26.3 0 top
U2  32.7,37.6 90 top
U3  35.1,15.1 270 top
U4  8.2,9.8 90 top
U$1  38.1,27 0 top
U$2  12.5,20.7 90 top
U$3  3.3,39.1 270 top
U$4  39.7,23 0 top
U$5  39.7,29.4 0 top
U$6  40.7,5.9 180 top
U$7  34.6,46 0 top
XTAL1  13.3,26.9 270 top
XTAL2  37.6,38.3 90 top
XTAL3  29.5,14.5 270 top

### Tracks (layer width: path | path; a pad name or v marks a point on that pad's centre or on a via)
0V
  Top 0.254: U$3.2 3.3,36.34 R18.2
  Top 0.305: U$3.2 3.3,42.1 2.7,42.7 2.7,43.19 C35.1
ACTIVE_GND
  Top 0.305: IC1.6 18.42,41.77 17.6,42.6 17.6,45.1 J2.P$1
  Top 0.406: IC1.7 IC1.6
ANT
  Top 0.254: C26.1 C22.1 37.48,6.92 38.1,6.3 38.1,5.44 U$6.RF
ANT1
  Top 0.254: U3.12 34.61,11.81 34.4,11.6 34.4,10.99 L3.1 34.1,11.29 L1.1
ANT2
  Top 0.254: U3.13 35.1,11.8 35.3,11.6 35.3,10.91 L3.2 35.3,10.89 L2.1
ANT3
  Top 0.254: U2.13 32.7,40.4 32.6,40.5 32.6,41.19 L6.2 32.59,42.1 L4.1
ANT4
  Top 0.254: U2.12 33.19,40.49 33.4,40.7 33.4,41.19 L6.1 33.41,42.5 L5.1
BT_KEY
  Top 0.254: U4.26 16.39,17.69 16.7,18 19.6,18 22.14,20.54 U1.17
BT_LED
  Top 0.254: U4.24 19.39,17.09 22.65,20.35 U1.18
DAC_OUT  (via drill 0.5)
  Top 0.254: U1.14 20.64,20.74 19.1,19.2 8.8,19.2 8,20
  Top 0.305: 10,35.74 R2.2 10.3,35.76 v10.3,34.9 | 8,20 8,20.1 v7.1,21
  Bottom 0.305: v7.1,21 5.3,21 4.8,21.5 4.8,29.4 v10.3,34.9
GND  (via drill 0.5)
  Top 0.254: U3.0 U3.8 31.9,15.1 31.6,15.4 | C26.2 33.4,8.4 C33.1 | C34.2 32.1,8.4 | U3.0 36.09,16.09 U3.20 37.95,17.01 C31.1 | 35.7,14.61 U3.17 38,14.6 38.86,13.74 R11.2 | 35.7,14.61 35.59,14.61 U3.0 | C32.2 31.02,18.72 30.5,18.2 | U3.14 35.59,14.5 35.7,14.61 | U2.0 U2.8 35.4,37.6 35.8,37.2 35.8,36.2 36.2,35.8 36.92,35.8 C19.1 37.02,34.98 37.3,34.7 | U2.14 32.21,38.09 | 32.21,38.09 U2.17 30.2,38.1 29.84,38.46 R14.2 | 32.21,38.09 U2.0 | U2.0 31.71,36.61 U2.20 30.77,36.48 29.8,35.5 29.21,35.5 C20.1 | 39.2,41.1 38.08,41.1 C18.1 | C17.2 34.5,45.4 35.68,44.22 C24.2 C23.1 35.68,42.38 35.7,42.4 | 25.16,27.94 U1.23 25.16,20.94 25.5,20.6 26.39,20.6 C13.1 | 25.16,27.94 24.5,28.6 21.7,28.6 20.9,28.6 | 20.9,28.6 20.5,28.2 20.5,25.4 | 20.5,25.4 20.5,24.5 21,24 24.7,24 25.1,24.4 | U1.8 20.36,25.54 20.5,25.4 | 20.9,28.6 20.64,28.86 U1.47 20.64,32.67 C15.1 20.5,32.99 20.5,34.8 21.74,36.04 R13.2 | 25.16,27.94 25.78,28.56 U1.35 28.06,28.56 28.7,29.2 29.21,29.2 C14.1 | C6.1 11.31,23.91 11.75,24.35 | C5.1 18.11,37.99 C2.1 18.01,36.6 C7.1 17.24,36.58 R7.2 | C12.1 21.26,38.6 R8.2 | C28.1 5.59,23.49 v6.2,24.1 | C25.1 22.31,3.37 U4.13 | 38.6,19.9 38.6,19.6 v38.8,19.4
  Top 0.305: 31.6,15.4 31.6,16.8 31,17.4 | 31,17.4 31,17.7 30.5,18.2 28.1,18.2 27.1,17.2 27.1,16.5 | 27.1,16.5 27.1,12.4 27.7,11.8 28,11.8 | 28,11.8 C29.1 | C30.1 31,17.4 | 33.4,8.4 32.1,8.4 31.4,8.4 28,11.8 | 37.3,34.7 37.4,34.7 | 37.4,34.7 37.7,34.7 | 37.7,34.7 39.2,34.7 39.9,35.4 39.9,40.4 39.2,41.1 37.9,42.4 | 35.7,42.4 37.9,42.4 | C21.2 37.1,34.4 37.4,34.7 | C8.1 12.82,23.28 | 12.82,23.28 12.9,23.2 14.6,23.2 15.5,24.1 v15.5,24.8 | v21.6,25.8 21.6,28.5 21.7,28.6 | C9.1 13.78,30.02 13.4,30.4 12.3,30.4 11.3,29.4 11.3,24.8 11.75,24.35 12.82,23.28 | U$1.3 38.42,28.73 39.1,29.4 | 39.1,29.4 U$5.P$1 | 39.1,29.4 38.6,29.9 38.6,30.5 C11.1 38.2,34.2 37.7,34.7 | v26.5,16.2 26.8,16.2 27.1,16.5 | 22.4,5.86 22.4,4.11 | R8.2 21.2,37.8 | 21.2,37.8 21.2,36.94 R13.2 | C2.1 21.01,37.99 21.2,37.8 | C10.1 38.6,19.9 | v10.2,44.7 10.7,45.2 11.1,45.2 11.36,44.94 R4.2 10.96,45.3 7.1,45.3 6.15,44.35 D1.2 6.15,43.05 5.8,42.7 5.8,35.71 C27.2 | 37.9,42.4 v37.6,42.1 | J3.GND 5.5,27.1 6.2,26.4 v6.2,24.1 | C36.1 25.91,42.91 v25.5,42.5
  Top 0.406: v22.1,7.7 22.4,7.4 22.4,5.86 U4.13
  Top 0.61: U$7.GND 35.65,46.25 v35.7,46.2
  Top 0.813: U$6.GND 40.25,5.75 v41.1,5.8
  Bottom 0.254: v6.2,24.1 5.7,24.1 5.6,24.2 | v38.8,19.4 39.5,19.4 39.7,19.6
  Bottom 0.305: v15.5,24.8 16.2,25.5 21.3,25.5 v21.6,25.8 | 39.7,19.6 39.7,11.5 38.7,10.5 35,10.5 30.1,15.4 27.3,15.4 v26.5,16.2 | 38.3,42.3 37.7,42.9 | 37.7,42.9 36.7,43.9 25.8,43.9 24.85,42.95 | 24.85,42.95 24.2,42.3 | 24.2,42.3 15.9,34 13.9,34 11.7,31.8 8.2,31.8 5.6,29.2 5.6,24.2 5.6,22.7 6.2,22.1 12.7,22.1 16,25.4 15.9,25.5 | v10.2,44.7 10.8,45.3 19.4,45.3 21.2,45.3 24.2,42.3 | v37.6,42.1 37.6,42.8 37.7,42.9 | v25.5,42.5 25.3,42.5 24.85,42.95
  Bottom 0.406: 21.3,25.5 17.4,25.5 16.2,24.3 16.2,13.6 21.35,8.45 | 21.35,8.45 v22.1,7.7 | 27.3,15.4 27.3,14.4 24.2,11.3 21.35,8.45 | 39.7,19.6 39.7,40.9 38.3,42.3
  Bottom 0.61: v35.7,46.2 20.3,46.2 19.4,45.3
  Bottom 0.813: 24.2,11.3 26.2,9.3 25.7,8.8 25.7,7.2 25.9,7 40.9,7 41,6.9 41,6.5 25.8,6.5 25.6,6.7 25.2,6.3 25.2,5.9 25.3,5.8 v41.1,5.8
  pour Top (isolate 0.406): 0.8,46.3 41.3,46.3 41.3,5.8 0.6,5.8 0.6,46.2
  pour Bottom (isolate 0.305): 0.7,46.1 41.2,46.1 41.2,5.6 0.5,5.6 0.5,46
MISO  (via drill 0.5)
  Top 0.254: U3.5 34.11,17.89 33.3,18.7 v33.3,21.1 | v31.4,24.7 31.3,24.7 31.2,24.6 | U1.27 31.25,24.55 v31.4,24.7 | v31.4,24.7 32.4,24.7 33,25.3 33,26 35.1,28.1 35.1,29.5 33.9,30.7 33.9,34.9 33.69,35.11 U2.5
  Bottom 0.254: v33.3,21.1 33.3,22.8 v31.4,24.7
MOSI  (via drill 0.5)
  Top 0.254: U3.4 34.61,18.59 34.4,18.8 v34.4,20.3 | v31.8,25.7 31.8,25.6 | U1.28 30.35,25.05 31,25.7 v31.8,25.7 | U2.4 33.19,30.31 34.5,29 34.5,28.4 v31.8,25.7
  Bottom 0.254: v34.4,20.3 34.4,23.1 v31.8,25.7
N$1
  Top 0.305: R1.2 R2.1 11.8,35.94 11.8,37.4 11.3,37.9 C1.1
N$2
  Top 0.305: IC1.2 12.48,42.42 12.2,42.7 11.34,42.7 R3.2 13.06,44.5 R4.1
N$3  (via drill 0.5)
  Top 0.254: IC1.1 14.9,44 v15,44.1 | C1.2 10.91,40.2 v9.5,40.2 9.1,39.8 C4.1
  Top 0.305: C1.2 R3.1
  Bottom 0.254: v15,44.1 13.4,44.1 v9.5,40.2
N$4
  Top 0.254: IC1.3 15.92,41.77 16.95,40.75 | 16.95,40.75 17.6,40.1 18.91,40.1 C2.2 | 16.95,40.75 16.4,40.2 16.4,33.8 16.2,33.6 14.94,33.6 R1.1
N$5  (via drill 0.5)
  Top 0.254: v20.9,41.6 20.9,40.64 R8.1
  Top 0.305: IC1.5 20.41,41.12 R8.1 | R9.1 8.8,33.5 9.5,32.8 v11.2,32.8
  Bottom 0.305: v20.9,41.6 20,41.6 v11.2,32.8
N$6
  Top 0.254: C4.2 9.1,37 8.8,36.7 R9.2
N$7
  Top 0.305: R5.1 C3.1
N$8
  Top 0.305: C3.2 D1.3
N$9
  Top 0.305: D1.1 9.56,43.6 R6.1
N$10
  Top 0.254: C29.2 29.98,13.03 XTAL3.3 32.46,13.4 U3.10
N$11
  Top 0.305: U$1.2 39.16,26.48 R10.1
N$12
  Top 0.254: C30.2 29.12,16.07 XTAL3.1 28.65,15.35 29.5,14.5 32.1,14.5 32.2,14.6 U3.9
N$13
  Top 0.254: L2.2 C22.2
N$14
  Top 0.254: U1.6 16.55,26.55 15.7,25.7 14.25,25.7 XTAL1.3 14.15,24.57 C8.2
N$15
  Top 0.254: U1.5 15.16,27.06 15,26.9 12.7,26.9 12.5,27.1 12.5,27.5 | 12.5,27.5 12.5,27.95 XTAL1.1 | C9.2 12.82,29.02 12.4,28.6 12.4,27.6 12.5,27.5
N$16
  Top 0.254: U3.11 34.11,12.63 L1.2 32.91,12.11 32.7,11.9 32.7,10.58 | 32.7,10.58 C33.2 | C34.1 32.1,9.98 32.7,10.58
N$17
  Top 0.254: U1.12 18.68,23.48 18.1,22.9 18.1,21.2 17.5,20.6 13.9,20.6 13.8,20.7 12.3,20.7 12.1,20.9 U$2.2
N$18
  Top 0.254: U1.13 19.48,22.08 18.9,21.5 18.9,21.2 17.7,20 12.95,20 U$2.3
N$19
  Top 0.254: U3.16 37.45,14.11 R11.1
N$20
  Top 0.254: U3.19 C31.2
N$21
  Top 0.254: U1.11 17.74,24.04 17.5,23.8 17.5,21.5 17.2,21.2 14.3,21.2 14,21.5 12.95,21.5 U$2.4
N$22
  Top 0.254: U$2.1 11.49,19.95 R12.1
N$23
  Top 0.254: U1.44 22.14,34.32 R13.1 22.86,34.36 J1.1
N$24
  Top 0.254: U2.10 35.29,38.59 36,39.3 36.65,39.3 XTAL2.3 36.75,40.73 C18.2
N$25
  Top 0.254: U2.11 33.69,39.69 34.7,40.7 34.7,41.78 C23.2 C24.1 34.3,43.41 L5.2
N$26
  Top 0.254: U2.16 30.77,39.02 29.7,40.1 29.14,40.1 R14.1
N$27
  Top 0.254: U2.19 29.91,37.11 29.7,36.9 29.19,36.9 C20.2
N$28
  Top 0.254: L4.2 C16.2
N$29
  Top 0.254: U2.9 35.69,38.09 35.9,38.3 37.5,38.3 38.45,37.35 XTAL2.1 38.4,37.15 38.4,35.9 38.2,35.7 C19.2
N$30
  Top 0.254: C16.1 33,45.38 C17.1
  Top 0.305: C16.1 32.1,46.45 U$7.RF
N$31
  Top 0.305: J3.VBUS 5.3,29.7 5.8,30.2 5.8,31.7 5.3,32.2 4,32.2 2.3,33.9 2.3,37.74 U$3.4 1.2,38.97 1.2,44.6 1.51,44.91 C35.2 2.6,45.2 3.4,46 D2.+
N$32
  Top 0.254: J3.D+ 6.1,28.4 6.65,27.85 | 6.65,27.85 7.26,27.24 R17.2 7.26,23.05 C28.2 | R15.1 6.66,27.86 6.65,27.85
N$33
  Top 0.254: J3.D- 6.05,29.05 7.06,30.06 R16.2 7.1,30.54 7.1,31.8 5.61,33.29 C27.1
N$34
  Top 0.254: R18.1 4.84,37.21 U$3.5
N$36
  Top 0.305: D2.- 5.76,45.5 R19.1
N$37
  Top 0.305: U$3.1 4.24,40.54 4.6,40.9 4.6,42.46 R19.2
PWM_GEN  (via drill 0.5)
  Top 0.254: U1.16 21.66,20.76 19.5,18.6 8.4,18.6 7.1,19.9
  Top 0.305: 7.1,19.9 v4,19.9 | v7.1,33.1 R5.2
  Bottom 0.305: v4,19.9 4,30 v7.1,33.1
RCV_CE
  Top 0.254: U3.1 36.09,17.89 36.8,18.6 36.8,20.4 34.6,22.6 30.6,22.6 29.6,21.6 29.6,20.6 28.8,19.8 25.4,19.8 24.65,20.55 U1.22
RCV_CS
  Top 0.254: U3.2 35.59,18.29 36.2,18.9 36.2,20 34.3,21.9 30.8,21.9 30.2,21.3 30.2,20.4 29,19.2 25.1,19.2 24.15,20.16 U1.21
SCLK  (via drill 0.5)
  Top 0.254: U3.3 35.1,19 v35.3,19.2 | v34.1,25.6 34.1,25.5 32.3,23.7 28.8,23.7 28.46,24.04 U1.26 | U2.3 32.7,29.5 v33.5,28.7
  Bottom 0.254: v35.3,19.2 35.3,24.4 v34.1,25.6 33.5,26.2 v33.5,28.7
TRN_CE
  Top 0.254: U1.42 23.15,32.85 23.7,33.4 30,33.4 31.71,35.11 U2.1
TRN_CS
  Top 0.254: U1.41 23.66,32.36 24.1,32.8 30.3,32.8 32.21,34.71 U2.2
UART1_RX  (via drill 0.5)
  Top 0.254: v30.2,26.9 29.8,26.9 29.6,26.7 29.1,26.7 28.95,26.55 U1.31
  Top 0.406: U4.1 4.39,7.39 9.5,12.5 17.2,12.5 v19.3,14.6
  Bottom 0.254: 24.5,26.5 28.3,26.5 28.5,26.7 30,26.7 v30.2,26.9
  Bottom 0.406: v19.3,14.6 20.4,15.7 20.4,22.4 24.5,26.5
UART1_TX  (via drill 0.5)
  Top 0.254: U1.30 29.25,26.05 v29.5,25.9
  Top 0.406: U4.2 5.89,7.49 9.8,11.4 18.4,11.4 v21.5,14.5
  Bottom 0.254: 25.3,25.8 25.5,26 29.2,26 v29.5,25.9
  Bottom 0.406: v21.5,14.5 21.5,22 25.3,25.8
USB_DM  (via drill 0.5)
  Top 0.254: U1.32 28.66,27.06 28.8,27.2 29.2,27.2 29.7,27.7 30.6,27.7 31.3,27 32.3,27 32.6,27.3 32.6,28.5 31.9,29.2 v30.7,29.2 | R16.1 8.74,30.06 v9.6,29.2
  Bottom 0.254: v9.6,29.2 9.8,29.2 10.5,28.5 30,28.5 v30.7,29.2
USB_DP  (via drill 0.5)
  Top 0.254: U1.33 28.24,27.55 29,28.3 31.2,28.3 v31.6,27.9 | 9.3,27 v9.6,27 8.94,26.34 R17.1
  Bottom 0.254: v31.6,27.9 10.5,27.9 v9.6,27
V-
  Top 0.254: C5.2 14.9,37.1 15.4,36.6 C7.2 15.56,36.58 R7.1
  Top 0.305: R6.2 10.04,41.96 10.1,41.9 12,41.9 12.8,41.1 14.88,41.1 IC1.4
  Top 0.406: IC1.4 C5.2
VBAT  (via drill 0.5)
  Top 0.254: C36.2 25.89,41.29 25.45,40.85
  Top 0.305: R10.2 39.6,23.9 39.7,23.8 U$4.P$1 38.7,23 | 38.7,23 38.5,23.2 38.5,24.9 | 38.5,24.9 38.5,25.1 37.78,25.83 U$1.1 | C10.2 38.6,22.9 38.7,23 | U$3.3 2.36,41.54 v2.1,41.8 | v20.4,44.1 22.2,44.1 25.45,40.85 v25.8,40.5 | v37.9,24.8 38.4,24.8 38.5,24.9
  Bottom 0.305: v2.1,41.8 4.5,41.8 7.1,39.2 15.5,39.2 v20.4,44.1 | v25.8,40.5 29.6,40.5 30.4,41.3 35.3,41.3 37.7,38.9 37.7,29.9 38.2,29.4 38.2,25.1 v37.9,24.8
VCC  (via drill 0.5)
  Top 0.254: U3.7 32.51,15.59 32.2,15.9 32.2,17.1 32.4,17.3 v32.4,17.7 32.4,18.5 32,18.9 C32.1 | U3.18 38.5,15.1 38.9,14.7 40.2,14.7 40.5,14.4 40.5,11.6 39.7,10.8 37.8,10.8 37.15,11.45 | 37.15,11.45 36.09,12.51 U3.15 | v37.5,12.2 37.5,11.8 37.15,11.45 | U2.7 35.09,37.11 35.3,36.9 v35.3,35.2 | U2.15 31.4,39.84 v31.4,40.3 30.5,41.2 28.7,41.2 28.1,40.6 28.1,38 28.5,37.6 U2.18 | C15.2 18.8,32.89 18.8,31.8 19,31.6 19.3,31.3 20.08,30.52 U1.48 | U1.36 27.12,29.12 28.3,30.3 29.09,30.3 C14.2 | U1.24 28.12,22.08 28.4,21.8 28.4,21.01 C13.2 28.41,22.31 v28.5,22.4 | U1.9 17.16,25.05 16.6,24.5 16.6,23.8 15.2,22.4 10.91,22.4 C6.2 10.79,22.3 10.2,22.3 9.7,22.3 9.06,21.66 R12.2 | C12.2 24.41,38.91 25.1,39.6 | R15.2 10.3,28 10.5,27.8 | C25.2 U4.12
  Top 0.305: C21.1 35.82,34.68 v35.3,35.2 34.7,34.6 | U$1.4 36.17,27.52 36.1,27.6 36.1,31.4 36.2,31.5 C11.2 | v28.1,30.8 28.1,30.5 28.3,30.3 | 19,31.6 18.7,31.6 v18.4,31.3 | U4.12 20.89,4.2 | IC1.8 21.62,43.08 25.1,39.6 27,37.7 27,35.96 J1.2
  Top 0.406: v36.3,26.7 36.3,27.4 36.17,27.52 | U4.12 20.89,10.59 v21.4,11.1 | 19.3,31.3 11.5,31.3 10.5,30.3 10.5,27.8 10.5,25.5 9.5,24.5 9.5,23 10.2,22.3 | 36.1,31.4 36,31.4 35.3,32.1 v35.3,35.2
  Bottom 0.254: v32.4,17.7 32.4,17.3 v37.5,12.2 | v35.3,35.2 35.3,36.4 v31.4,40.3 | J1.2 26.94,34.34 26.9,34.3
  Bottom 0.305: v28.5,22.4 29.7,22.4 30.5,23.2 30.5,25.1 30.9,25.5 30.9,26 31.5,26.6 31.9,26.6 32.5,27.2 32.5,28.8 30.1,31.2 | v28.1,30.8 28.5,31.2 30.1,31.2 | v18.4,31.3 18.4,33.7 19,34.3 26.9,34.3 34.4,34.3 v35.3,35.2 | 30.1,31.2 28.7,34.2
  Bottom 0.406: v28.5,22.4 29.5,22.4 33.8,18.1 | 33.8,18.1 36.7,18.1 37.4,18.8 37.4,20.7 36.3,21.8 v36.3,26.7 | 33.8,18.1 32.8,18.1 v32.4,17.7 32.2,17.9 26.2,17.9 25.3,17 25.3,15.1 21.4,11.2 v21.4,11.1